# Altium schematic sheet Power.SchDoc
size A
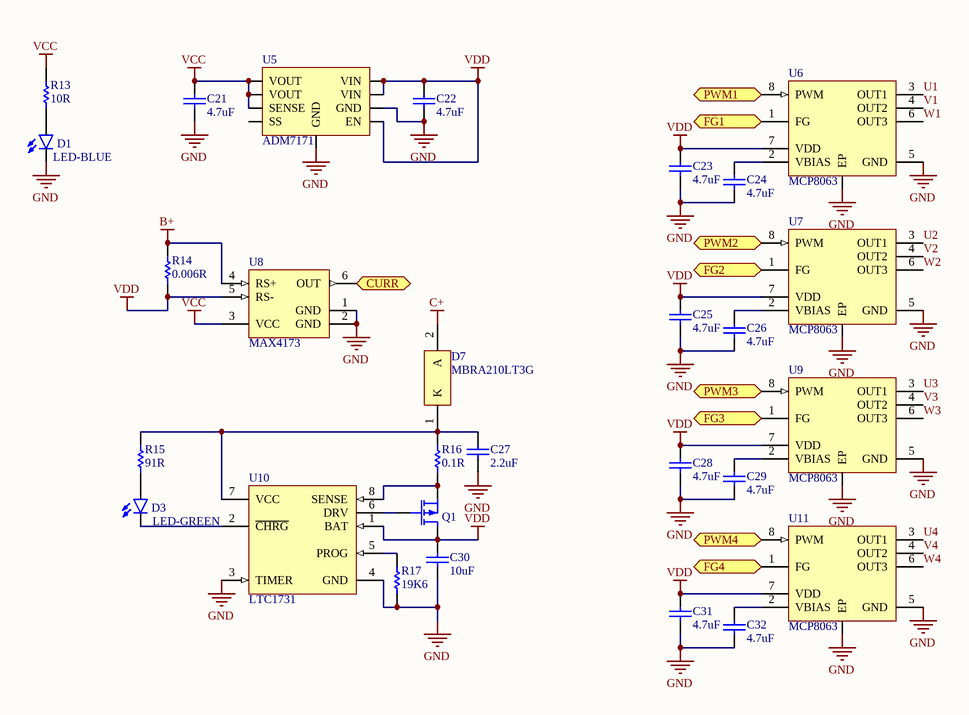
[diagram p0: Power.SchDoc]

## Parts
C21  4.7uF  [CAPC0402(1005)60_L]
C22  4.7uF  [CAPC0402(1005)60_L]
C23  4.7uF  [CAPC0402(1005)60_L]
C24  4.7uF  [CAPC0402(1005)60_L]
C25  4.7uF  [CAPC0402(1005)60_L]
C26  4.7uF  [CAPC0402(1005)60_L]
C27  2.2uF  [CAPC0402(1005)60_M]
C28  4.7uF  [CAPC0402(1005)60_L]
C29  4.7uF  [CAPC0402(1005)60_L]
C30  10uF  [CAPC0402(1005)60_N]
C31  4.7uF  [CAPC0402(1005)60_L]
C32  4.7uF  [CAPC0402(1005)60_L]
D1  LED-BLUE  [LED-1206]
D3  LED-GREEN  [LED-1206]
D7  MBRA210LT3G  [ONSC-SMA-2-403D-02_F_V]
Q1  MOSFET-P  [SOT23-3]  (value not drawn)
R13  10R  [RESC0402(1005)_N]
R14  0.006R  [RESC0805(2012)_N]
R15  91R  [RESC0402(1005)_M]
R16  0.1R  [RESC0603(1608)_M]
R17  19K6  [RESC0402(1005)_M]
U5  ADM7171  [SON50P300X85_HS-9N]
U6  MCP8063  [DFN8]
U7  MCP8063  [DFN8]
U8  MAX4173  [MAXM-U6+1_M]
U9  MCP8063  [DFN8]
U10  LTC1731  [LT-MS8-8_L]
U11  MCP8063  [DFN8]

## Ports
CURR (out), FG1 (out), FG2 (out), FG3 (out), FG4 (out), PWM1 (in), PWM2 (in), PWM3 (in), PWM4 (in)

## Nets
B+: R14.2 U8.4(RS+)
C+: D7.2(A)
GND: C21.1 C22.1 C23.1 C24.2 C25.1 C26.2 C27.1 C28.1 C29.2 C30.1 C31.1 C32.2 D1.C R17.1 U5.6(GND) U5.9(GND) U6.5(GND) U6.9(EP) U7.5(GND) U7.9(EP) U8.1(GND) U8.2(GND) U9.5(GND) U9.9(EP) U10.3(TIMER) U10.4(GND) U11.5(GND) U11.9(EP)
VCC: C21.2 R13.2 U5.1(VOUT) U5.2(VOUT) U5.3(SENSE) U8.3(VCC)
VDD: C22.2 C23.2 C25.2 C28.2 C30.2 C31.2 Q1.2(D) R14.1 U5.5(EN) U5.7(VIN) U5.8(VIN) U6.7(VDD) U7.7(VDD) U8.5(RS-) U9.7(VDD) U10.1(BAT) U11.7(VDD)
CURR: U8.6(OUT) ; port CURR
FG1: U6.1(FG) ; port FG1
FG2: U7.1(FG) ; port FG2
FG3: U9.1(FG) ; port FG3
FG4: U11.1(FG) ; port FG4
PWM1: U6.8(PWM) ; port PWM1
PWM2: U7.8(PWM) ; port PWM2
PWM3: U9.8(PWM) ; port PWM3
PWM4: U11.8(PWM) ; port PWM4
U1: U6.3(OUT1)
U2: U7.3(OUT1)
U3: U9.3(OUT1)
U4: U11.3(OUT1)
V1: U6.4(OUT2)
V2: U7.4(OUT2)
V3: U9.4(OUT2)
V4: U11.4(OUT2)
W1: U6.6(OUT3)
W2: U7.6(OUT3)
W3: U9.6(OUT3)
W4: U11.6(OUT3)
NetC24_1: C24.1 U6.2(VBIAS)
NetC26_1: C26.1 U7.2(VBIAS)
NetC27_2: C27.2 D7.1(K) R15.2 R16.2 U10.7(VCC)
NetC29_1: C29.1 U9.2(VBIAS)
NetC32_1: C32.1 U11.2(VBIAS)
NetD1_A: D1.A R13.1
NetD3_A: D3.A R15.1
NetD3_C: D3.C U10.2(~{CHRG})
NetQ1_1: Q1.1(G) U10.6(DRV)
NetQ1_3: Q1.3(S) R16.1 U10.8(SENSE)
NetR17_2: R17.2 U10.5(PROG)

Not connected (* = marked no-connect by the designer): U5 4(SS)

## Library data of the parts
C21-C26 C28 C29 C31 C32 = CMP-1034-02136-1: CAP 4.7uF 6.3V ±10% 0402 (1005 Metric) Thickness 0.6mm SMD; Case-EIA: 0402; Tolerance: Â±10%; Case-Metric: 1005; Technology: SMT; Value: 4.7uF; Max Thickness: 0.6 mm; Rated Voltage: 6.3 V
C27 = CMP-1034-02125-1: CAP 2.2uF 6.3V ±10% 0402 (1005 Metric) Thickness 0.6mm SMD; Case-Metric: 1005; Case-EIA: 0402; Tolerance: Â±10%; Value: 2.2uF; Technology: SMT; Rated Voltage: 6.3 V; Max Thickness: 0.6 mm
C30 = CMP-1034-02138-1: CAP 10uF 6.3V ±20% 0402 (1005 Metric) Thickness 0.6mm SMD; Case-Metric: 1005; Case-EIA: 0402; Tolerance: Â±20%; Rated Voltage: 6.3 V; Technology: SMT; Max Thickness: 0.6 mm; Value: 10uF
D1 = LED-BLUE1206: PROD_ID: DIO-09911
D3 = LED-GREEN1206: PROD_ID: DIO-00862
D7 = CMP-1055-00309-1: Schottky Power Rectifier, 2-Pin SMA, Pb-Free, Tape and Reel; Manufacturer: On Semiconductor; IFSM Max (A): 160; Configuration: Single; ComponentLink3URL: http://www.onsemi.com/pub_link/Collateral/1SMA5913BT3-D.PDF; Packing: Tape and Reel; ComponentLink2Description: Datasheet; ComponentLink3Description: Package Specification; PackageVersion: Rev. F, 11/2008; DatasheetVersion: Rev. 5; RoHS: TRUE; PackageReference: SMA-2-403D-02_F; ComponentLink1URL: http://www.onsemi.com/; ComponentLink2URL: http://www.onsemi.cn/pub_link/Collateral/MBRA210LT3-D.PDF; ComponentLink1Description: Manufacturer URL; PartNumber: MBRA210LT3G; Mounting Technology: Surface Mount; PackageDescription: 2-Pin Small Molded Package, J-Bend Lead, Body 2.605 x 4.315 mm
Q1 = MOSFET-P: P-Channel MOSFET; Published: 8-Jun-2000; LatestRevisionDate: 17-Jul-2002; LatestRevisionNote: Re-released for DXP Platform.; PackageVersion: 1995/1996; PackageReference: E3; Publisher: Altium Limited; PackageDescription: TO, Flat Index; 3 In-Line, Axial Leads; Body Dia. 4.6mm; Lead Dia. 0.5 mm (max)
R13 = CMP-1011-00026-1: 10R 0.063W 5% 0402 (1005 Metric)  SMD; Case-EIA: 0402; Case-Metric: 1005; Value: 10.00 Ohm; Power: 0.063 W; Tolerance: 5 %; Technology: SMT
R14 = CMP-1013-00001-1: Jumper 0805 (2012 Metric); Case-EIA: 0805; Value: 0.00 Ohm; Tolerance: None; Case-Metric: 2012; Technology: SMT; Power: None
R15 = CMP-1011-00049-1: 91R 0.063W 5% 0402 (1005 Metric)  SMD; Case-EIA: 0402; Value: 91.00 Ohm; Case-Metric: 1005; Technology: SMT; Power: 0.063 W; Tolerance: 5 %
R16 = CMP-1012-00002-1: 1R 0.1W 5% 0603 (1608 Metric)  SMD; Value: 1.00 Ohm; Case-Metric: 1608; Case-EIA: 0603; Power: 0.1 W; Technology: SMT; Tolerance: 5 %
R17 = CMP-1011-00105-1: 20K 0.063W 5% 0402 (1005 Metric)  SMD; Case-EIA: 0402; Value: 20000.00 Ohm; Case-Metric: 1005; Tolerance: 5 %; Power: 0.063 W; Technology: SMT
U6 U7 U9 U11 = MCP8063: 3-Phase Brushless DC Sinusoidal Sensorless Fan Motor Driver, MOSFET Output, 2 to 14 V, 8-pin SOP (SE8), Tube; PartNumber: MTD6501G-HC1; Manufacturer: Microchip; DatasheetVersion: Rev. B; ComponentLink1Description: Manufacturer URL; PackageDescription: 8-Lead Thermally Enhanced Plastic Small Outline, 4.9 x 3.9 mm Body, 1.27 mm Pitch; ComponentLink1URL: http://www.microchip.com; ComponentLink4URL: http://www.microchip.com/MTD6501G; ComponentLink3URL: http://www.microchip.com/stellent/groups/techpub_sg/documents/packagingspec/en012702.pdf; PackageVersion: C04-121A; ComponentLink2URL: http://ww1.microchip.com/downloads/en/DeviceDoc/22263B.pdf; ComponentLink2Description: Datasheet; ComponentLink3Description: Package Specification; PackageReference: SOP-SE8; Mounting Technology: Surface Mount; ComponentLink4Description: Product URL
U8 = CMP-0252-00331-1: Voltage-Output, High-Side Current-Sense Amplifier, 50 V / V Gain, -40 to 85 degC, 6-Pin SOT23 (U6+1), Pb-Free, Tape and Reel; PartNumber: MAX4173FEUT+T; Gain: 20 V/V, 50 V/V ,100 V/V; Bi-Dir. Curr. Sense: No; ComponentLink2URL: http://datasheets.maximintegrated.com/en/ds/MAX4173-MAX4173T.pdf; ComponentLink3URL: http://pdfserv.maximintegrated.com/package_dwgs/21-0058.PDF; ComponentLink3Description: Package Specification; DatasheetVersion: Rev. 5; PackageDescription: 6-Pin Small-Outline Transistor Package (U6+1), Body 2.9 x 1.625 mm, Pitch 0.95 mm; PackageReference: U6+1; Code_JEDEC: MO178; ComponentLink1Description: Manufacturer URL; Mounting Technology: Surface Mount; PackageVersion: Rev. N, 08/2012; ComponentLink1URL: http://www.maximintegrated.com/; ComponentLink2Description: Datasheet
U10 = CMP-0471-00369-1: Linear Charger with AC Adapter Detection, 4.5 to 12 V Vin, 8-pin SOP (MS8-8), -40 to 85 degC, Pb-Free, Tape and Reel; PartNumber: LTC1731EMS8-4.2#TRPBF; Manufacturer: Linear Technology; Float Voltage: 4.2 V; Battery Chemistry: Li-Ion, Li-Polymer; Vin Min(V): 4.5; Number of Cells: 1; Vin Max(V): 12; Charge Termination: On-board timer; ComponentLink3Description: Package Specification; ComponentLink2Description: Datasheet; Packing: Tape and Reel; PackageDescription: 8-Pin Plastic MSOP, Body 3 x 3 mm, Pitch 0.65 mm; ComponentLink3URL: http://cds.linear.com/docs/en/packaging/05081660_G_MS8.pdf; ComponentLink1URL: http://www.linear.com/; RoHS: TRUE; PackageReference: MS8-8; Mounting Technology: Surface Mount; Type of Charger: Linear; PackageVersion: Rev. G, 03/2012; ComponentLink2URL: http://cds.linear.com/docs/en/datasheet/1731f.pdf; ComponentLink1Description: Manufacturer URL